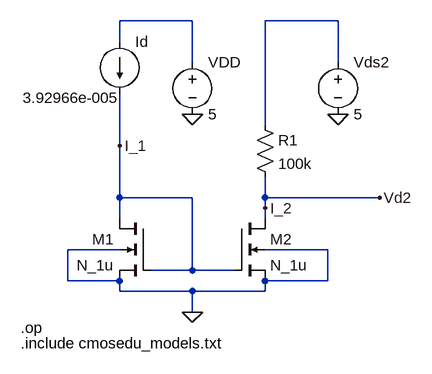
[diagram p0: schematic Parte 4.asc]
Parte 4.asc, the LTspice schematic file:
Version 4
SHEET 1 880 680
WIRE -32 -192 -144 -192
WIRE 192 -192 80 -192
WIRE -144 -160 -144 -192
WIRE -32 -128 -32 -192
WIRE 192 -128 192 -192
WIRE 80 -32 80 -192
WIRE -144 0 -144 -80
WIRE -144 80 -144 0
WIRE -32 80 -144 80
WIRE 80 80 80 48
WIRE 256 80 80 80
WIRE 80 96 80 80
WIRE -144 112 -144 80
WIRE 80 112 80 96
WIRE -144 160 -224 160
WIRE 176 160 80 160
WIRE -32 192 -32 80
WIRE -32 192 -96 192
WIRE 32 192 -32 192
WIRE -224 208 -224 160
WIRE -144 208 -224 208
WIRE 176 208 176 160
WIRE 176 208 80 208
WIRE -144 224 -144 208
WIRE -32 224 -144 224
WIRE 80 224 80 208
WIRE 80 224 -32 224
WIRE -32 256 -32 224
FLAG -32 256 0
FLAG -32 -48 0
FLAG -144 0 I_1
FLAG 80 96 I_2
FLAG 192 -48 0
FLAG 256 80 Vd2
SYMBOL nmos4 32 112 R0
SYMATTR InstName M2
SYMATTR Value N_1u
SYMATTR Value2 l=1.5u w=3u
SYMBOL res 64 -48 R0
SYMATTR InstName R1
SYMATTR Value 100k
SYMBOL current -144 -160 R0
WINDOW 3 -149 86 Left 2
WINDOW 123 0 0 Left 2
WINDOW 39 0 0 Left 2
SYMATTR Value 3.92966e-005
SYMATTR InstName Id
SYMBOL voltage -32 -144 R0
WINDOW 123 0 0 Left 2
WINDOW 39 0 0 Left 2
SYMATTR InstName VDD
SYMATTR Value 5
SYMBOL voltage 192 -144 R0
WINDOW 123 0 0 Left 2
WINDOW 39 0 0 Left 2
SYMATTR InstName Vds2
SYMATTR Value 5
SYMBOL nmos4 -96 112 M0
SYMATTR InstName M1
SYMATTR Value N_1u
SYMATTR Value2 l=1.5u w=3u
TEXT -296 280 Left 2 !.op
TEXT -296 304 Left 2 !.include cmosedu_models.txt

The netlist it stands for:
* Parte 4.asc
M2 Vd2 I_1 0 0 N_1u l=1.5u w=3u
R1 N002 Vd2 100k
Id N001 I_1 3.92966e-005
VDD N001 0 5
Vds2 N002 0 5
M1 I_1 I_1 0 0 N_1u l=1.5u w=3u
.model NMOS NMOS
.model PMOS PMOS
.lib standard.mos
.op
.include cmosedu_models.txt
.backanno
.end